# EAGLE board eTapper1main49 (EAGLE 8.4.3)
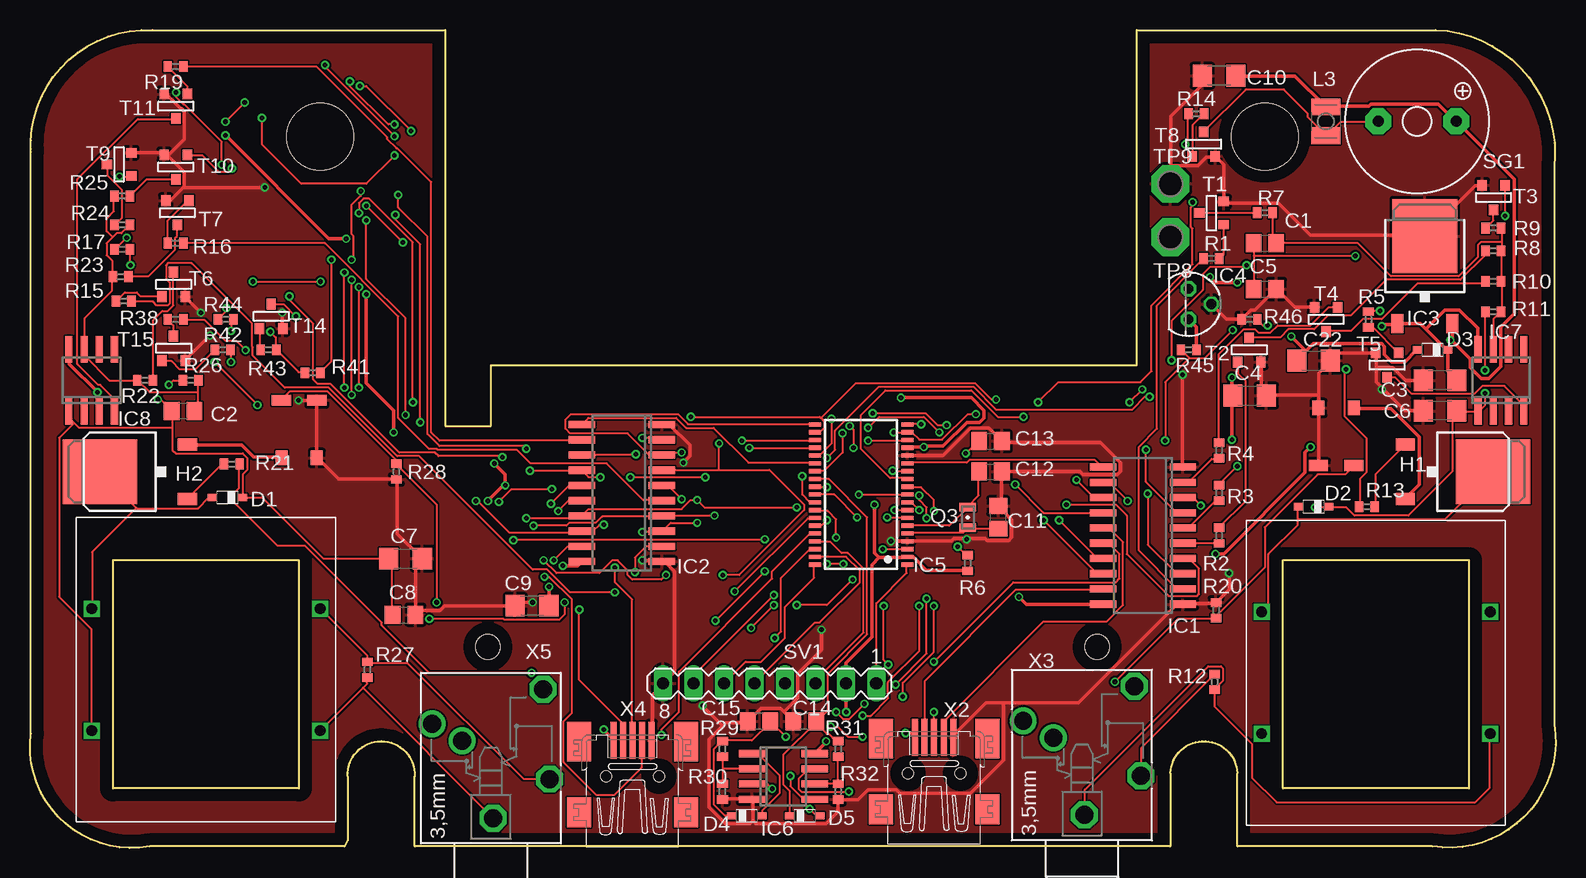
[diagram p1: board, top side]
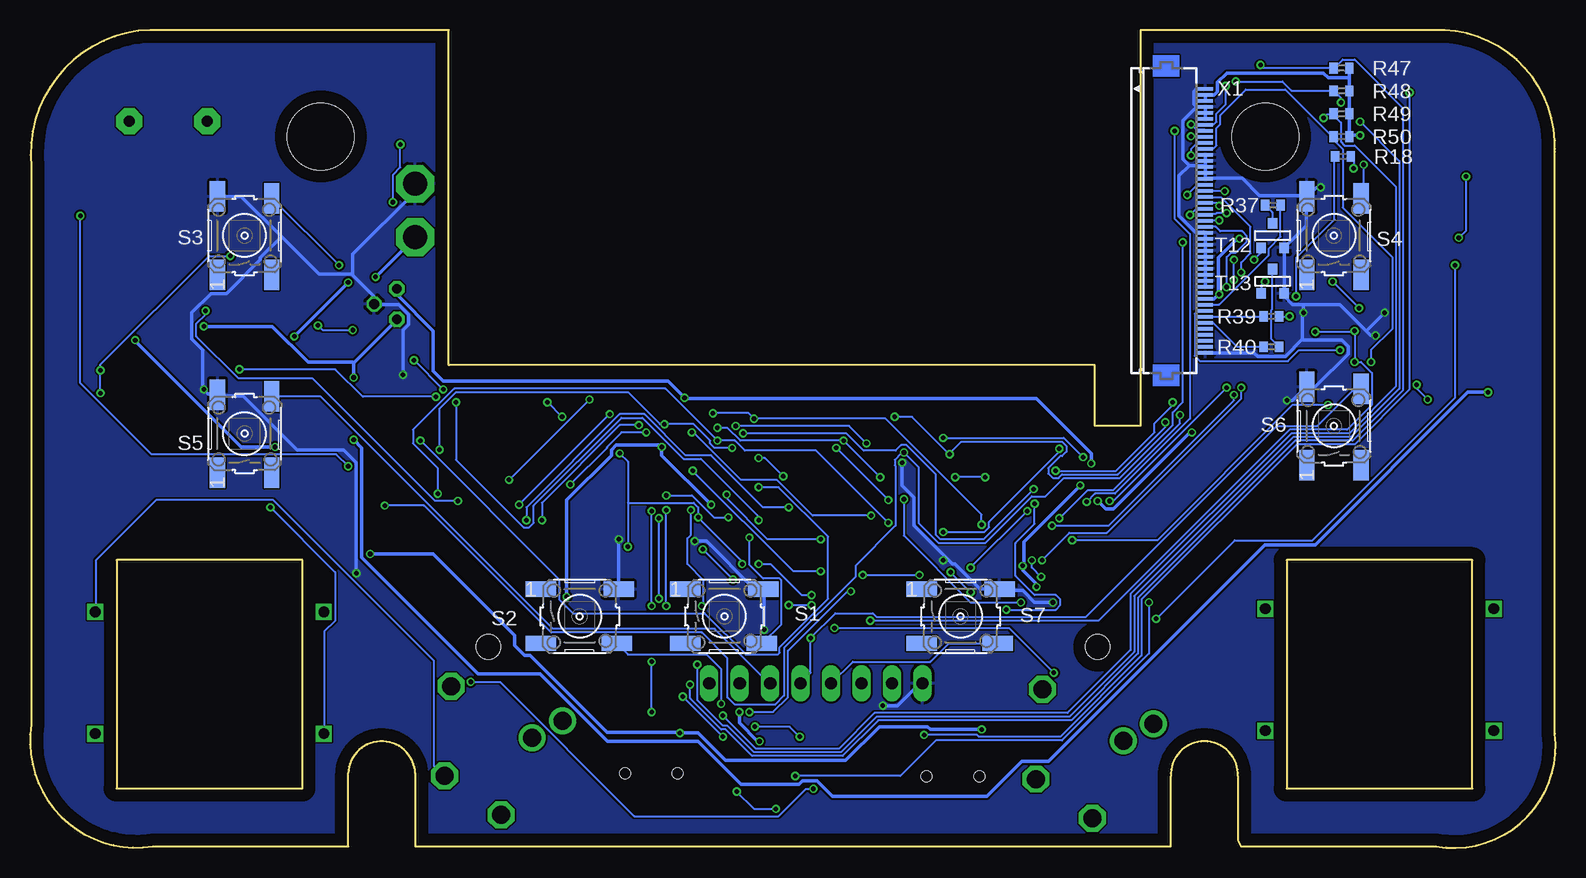
[diagram p2: board, bottom side, seen from below]

Size 127.17 x 68.21 mm. Coordinates in mm from the lower left corner, seen from the top.
Outline: 0.06,58.04 0.06,58.3 0.06,9.53
Outline: 0.06,58.04 0.06,9.53
Outline: 0.06,58.04 arc-96 10.22,68.2 34.61,68.2 34.61,35.18 38.42,35.18 38.42,40.26 92.27,40.26 92.27,68.2 117.16,68.2 arc-94 127.06,56.77 127.06,10.29 arc-108 116.9,0.13 100.65,0.13 100.65,6.23 arc175 95.06,6.23 95.06,0.13 32.07,0.13 32.07,5.97 arc185 26.48,5.97 26.48,0.64 26.23,0.13 9.97,0.13 arc-107 0.06,9.53
Outline: 104.46,24.01 119.95,24.01 119.95,4.96 104.46,4.96 104.46,24.01
Outline: 6.92,24.01 22.42,24.01 22.42,4.96 6.92,4.96 6.92,24.01
Copper layers (1*16): Top 0.035mm / dielectric 30mil / Bottom 0.035mm
Design rules "default *": minimum track width 6mil, minimum drill 15mil, track to track 6mil, track to pad 6mil, pad to pad 6mil, via to via 6mil, smd to smd 6mil, copper to edge 40mil, drill to drill 6mil, minimum pad ring 6mil, minimum via ring 6mil, stop-mask expansion 4mil, vias tented up to drill 0mil, thermal gap 10mil
Net classes: 1 GND: width 0.305 mm, clearance 0.152 mm; 2 BAT+: width 0.305 mm, clearance 0.152 mm; 3 +9V: width 0.305 mm, clearance 0.152 mm; 4 +3V: width 0.305 mm, clearance 0.152 mm; 5 VCC: width 0.305 mm, clearance 0.152 mm
Holes 5.59 mm at 24.19,59.31 102.93,59.31
Holes 2.03 mm at 38.16,16.77 88.96,16.77

## Footprints (pad centres in the part's own frame; a part is rotated, then mirrored left to right if it is on the bottom)
C0805 = smd 1.3 x 1.5: 1 -0.95,0; 2 0.95,0
C1206 = smd 1.6 x 1.8: 1 -1.4,0; 2 1.4,0
SOD323_ST = smd 0.8 x 0.6: A 1.25,0; C -1.25,0
XFMR = drill 0.889 square: P$1 -10.16,5.08; P$2 -10.16,-5.08; P$3 8.89,5.08; P$4 8.89,-5.08
D-PAK_TO252AA = smd 1 x 1.6: 1 -2.28,-4.8; 3 2.28,-4.8 | smd 5.4 x 6.2: 4 0,2.5
SO20 = smd 0.6 x 2.2: 1 -5.715,-3.33; 2 -4.445,-3.33; 3 -3.175,-3.33; 4 -1.905,-3.33; 5 -0.635,-3.33; 6 0.635,-3.33; 7 1.905,-3.33; 8 3.175,-3.33; 9 4.445,-3.33; 10 5.715,-3.33; 11 5.715,3.33; 12 4.445,3.33; 13 3.175,3.33; 14 1.905,3.33; 15 0.635,3.33; 16 -0.635,3.33; 17 -1.905,3.33; 18 -3.175,3.33; 19 -4.445,3.33; 20 -5.715,3.33
TO252 = smd 1 x 1.6: 1 -2.28,-4.8; 3 2.28,-4.8 | smd 5.4 x 6.2: 2 0,2.5
TO92 = drill 0.813 pad 1.27 octagon: 1 -1.27,0; 2 0,1.905; 3 1.27,0
TSSOP38_R-PDSO-G38-DA = smd 0.35 x 1: 1 -5.85,-3.85; 2 -5.2,-3.85; 3 -4.55,-3.85; 4 -3.9,-3.85; 5 -3.25,-3.85; 6 -2.6,-3.85; 7 -1.95,-3.85; 8 -1.3,-3.85; 9 -0.65,-3.85; 10 0,-3.85; 11 0.65,-3.85; 12 1.3,-3.85; 13 1.95,-3.85; 14 2.6,-3.85; 15 3.25,-3.85; 16 3.9,-3.85; 17 4.55,-3.85; 18 5.2,-3.85; 19 5.85,-3.85; 20 5.85,3.85; 21 5.2,3.85; 22 4.55,3.85; 23 3.9,3.85; 24 3.25,3.85; 25 2.6,3.85; 26 1.95,3.85; 27 1.3,3.85; 28 0.65,3.85; 29 0,3.85; 30 -0.65,3.85; 31 -1.3,3.85; 32 -1.95,3.85; 33 -2.6,3.85; 34 -3.25,3.85; 35 -3.9,3.85; 36 -4.55,3.85; 37 -5.2,3.85; 38 -5.85,3.85
SO8 = smd 0.6 x 2.2: 1 -1.905,-2.6; 2 -0.635,-2.6; 3 0.635,-2.6; 4 1.905,-2.6; 5 1.905,2.6; 6 0.635,2.6; 7 -0.635,2.6; 8 -1.905,2.6
SO08 = smd 0.6 x 2.2: 1 -1.905,-2.6; 2 -0.635,-2.6; 3 0.635,-2.6; 4 1.905,-2.6; 5 1.905,2.6; 6 0.635,2.6; 7 -0.635,2.6; 8 -1.905,2.6
L2825P = smd 1.4 x 2.4: 1 -1.2,0; 2 1.2,0
FC-12M = smd 0.7 x 1.4: 1 -0.85,0; 2 0.85,0
R0402 = smd 0.7 x 0.9: 1 -0.65,0; 2 0.65,0
B3F-10XX = smd 2.54 x 1.27: 1 -3.251,2.261; 2 3.251,2.261; 3 -3.251,-2.261; 4 3.099,-2.261
F/QMBIII = drill 0.914 pad 2.159 octagon: + 3.251,0; - -3.251,0
MA08-1 = drill 1.016 long: 1 -8.89,0; 2 -6.35,0; 3 -3.81,0; 4 -1.27,0; 5 1.27,0; 6 3.81,0; 7 6.35,0; 8 8.89,0
SOT-23 = smd 0.787 x 0.889: 1 0.025,-1.016; 2 -0.94,1.016; 3 0.991,1.016
P1-20 = drill 2.007 pad 3.15 octagon: TP 0,0
CT02-250 = smd 1 x 1.2: P$1 -1.45,-2.4; P$2 1.5,-2.4 | smd 1.6 x 0.9: P$3 1.5,2.4; P$4 -1.45,2.4
FH12-45S-0.5SH = smd 0.3 x 1.3: 1 -13,3.25; 2 -12.5,3.25; 3 -12,3.25; 4 -11.5,3.25; 5 -11,3.25; 6 -10.5,3.25; 7 -10,3.25; 8 -9.5,3.25; 9 -9,3.25; 10 -8.5,3.25; 11 -8,3.25; 12 -7.5,3.25; 13 -7,3.25; 14 -6.5,3.25; 15 -6,3.25; 16 -5.5,3.25; 17 -5,3.25; 18 -4.5,3.25; 19 -4,3.25; 20 -3.5,3.25; 21 -3,3.25; 22 -2.5,3.25; 23 -2,3.25; 24 -1.5,3.25; 25 -1,3.25; 26 -0.5,3.25; 27 0,3.25; 28 0.5,3.25; 29 1,3.25; 30 1.5,3.25; 31 2,3.25; 32 2.5,3.25; 33 3,3.25; 34 3.5,3.25; 35 4,3.25; 36 4.5,3.25; 37 5,3.25; 38 5.5,3.25; 39 6,3.25; 40 6.5,3.25; 41 7,3.25; 42 7.5,3.25; 43 8,3.25; 44 8.5,3.25; 45 9,3.25
32005-201 = smd 3.1 x 0.5: 1 3,1.6; 2 3,0.8; 3 3,0; 4 3,-0.8; 5 3,-1.6 | smd 2.5 x 2: M1 -3,-4.45; M2 -3,4.45 | smd 3.3 x 2: M3 2.9,4.45; M4 2.9,-4.45 | hole 0.9: 0,2.2; 0,-2.2
PG203J = drill 1.499 octagon: 1 -5.004,-0.203; 4 5.74,-4.369; 5 -1.753,-4.902 | drill 1.499: 2 2.845,4.902; 3 1.448,2.388

## Placement (x,y rotation side)
C1  .01uF  [C0805]  102.93,50.42 0 top
C2  .01uF  [C0805]  12.76,36.45 0 top
C3  [C1206]  117.54,38.99 180 top
C4  [C1206]  101.66,37.72 0 top
C5  3.3uF  [C0805]  102.93,46.61 0 top
C6  220uF  [C1206]  117.54,36.45 180 top
C7  220uF  [C1206]  31.31,24.14 0 top
C8  3.3uF  [C0805]  31.18,19.44 0 top
C9  47uF  [C1206]  41.85,20.2 180 top
C10  47uF  [C1206]  99.12,64.39 180 top
C11  12pF  [C0805]  80.71,27.56 90 top
C12  12pF  [C0805]  80.07,31.37 0 top
C13  1 uF  [C0805]  80.07,33.91 0 top
C14  0.1uF  [C0805]  64.58,10.55 180 top
C15  0.1uF  [C0805]  60.77,10.55 180 top
C22  220uF  [C1206]  107,40.65 0 top
D1  BAT60J  [SOD323_ST]  16.45,29.22 180 top
D2  BAT60J  [SOD323_ST]  107,28.45 180 top
D3  BAT60J  [SOD323_ST]  116.9,41.53 180 top
D4  BAT60J  [SOD323_ST]  59.75,2.67 0 top
D5  BAT60J  [SOD323_ST]  64.58,2.67 0 top
DRILEGEND  [DRILEGEND]  -4.51,-8.34 0 top  (outside the outline)
F1  XFMR  [XFMR]  112.84,14.61 0 top
F2  XFMR  [XFMR]  15.3,14.86 0 top
H1  IRLR024N  [D-PAK_TO252AA]  119.44,31.37 270 top
H2  IRLR024N  [D-PAK_TO252AA]  8.32,31.37 90 top
IC1  74AC373  [SO20]  92.77,26.04 90 top
IC2  74AC373  [SO20]  49.34,29.6 90 top
IC3  LM2936DT-5.0  [TO252]  116.27,48.52 0 top
IC4  LM2936Z-3.0  [TO92]  96.58,45.34 270 top
IC5  MSP430F2232IDA  [TSSOP38_R-PDSO-G38-DA]  69.28,29.47 90 top
IC6  AD8620R  [SO8]  62.8,5.97 270 top
IC7  LP2951M  [SO08]  122.62,38.99 0 top
IC8  LP2951M  [SO08]  5.14,38.99 0 top
L3  470uH  [L2825P]  108.01,60.58 270 top
Q3  FC-12M  [FC-12M]  78.17,27.56 90 top
R1  47K  [R0402]  98.49,49.15 0 top
R2  47K  [R0402]  99.12,26.04 90 top
R3  47K  [R0402]  99.12,29.6 90 top
R4  47K  [R0402]  99.12,33.15 90 top
R5  47K  [R0402]  111.57,44.07 270 top
R6  47K  [R0402]  78.17,23.75 270 top
R7  1K  [R0402]  102.93,52.96 0 top
R8  3K  [R0402]  121.98,49.79 0 top
R9  6K  [R0402]  121.98,51.69 0 top
R10  12K  [R0402]  121.98,47.25 0 top
R11  3K  [R0402]  121.98,44.71 0 top
R12  51K  [R0402]  98.74,13.85 270 top
R13  1K  [R0402]  111.44,28.45 0 top
R14  1K  [R0402]  97.22,61.22 0 top
R15  47K  [R0402]  7.81,45.6 180 top
R16  47K  [R0402]  12.13,50.42 180 top
R17  47K  [R0402]  7.68,49.92 180 top
R18  47K  [R0402]  17.72,57.66 0 bottom
R19  47K  [R0402]  12.13,65.16 180 top
R20  47K  [R0402]  98.87,19.82 90 top
R21  1K  [R0402]  16.83,32.01 180 top
R22  1K  [R0402]  9.59,38.99 180 top
R23  3K  [R0402]  7.56,47.63 180 top
R24  6K  [R0402]  7.68,51.95 0 top
R25  12K  [R0402]  7.68,54.36 180 top
R26  3K  [R0402]  13.4,38.99 0 top
R27  51K  [R0402]  28.13,14.86 270 top
R28  47K  [R0402]  30.54,31.37 270 top
R29  50K  [R0402]  57.72,8.26 90 top
R30  1K  [R0402]  57.72,4.7 90 top
R31  50K  [R0402]  67.37,8.26 90 top
R32  1K  [R0402]  67.37,4.7 90 top
R37  100  [R0402]  23.56,53.6 0 bottom
R38  100  [R0402]  12.13,44.07 0 top
R39  100  [R0402]  23.69,44.33 180 bottom
R40  100  [R0402]  23.69,41.79 180 bottom
R41  47K  [R0402]  23.56,39.63 0 top
R42  47K  [R0402]  16.07,41.53 180 top
R43  47K  [R0402]  19.88,41.53 180 top
R44  47K  [R0402]  16.32,44.07 180 top
R45  47K  [R0402]  96.58,41.53 0 top
R46  10K  [R0402]  101.66,44.07 0 top
R47  47K  [R0402]  17.84,65.03 0 bottom
R48  47K  [R0402]  17.84,63.12 0 bottom
R49  47K  [R0402]  17.84,61.22 0 bottom
R50  47K  [R0402]  17.84,59.31 0 bottom
S1  [B3F-10XX]  69.28,19.31 0 bottom
S2  [B3F-10XX]  81.34,19.31 0 bottom
S3  [B3F-10XX]  109.28,51.06 90 bottom
S4  [B3F-10XX]  18.48,51.06 90 bottom
S5  [B3F-10XX]  109.28,34.55 90 bottom
S6  [B3F-10XX]  18.48,35.18 90 bottom
S7  [B3F-10XX]  49.59,19.31 0 bottom
SG1  F/QMBIII  [F/QMBIII]  115.63,60.58 0 top
SV1  100mil  [MA08-1]  61.66,13.72 180 top
T1  2N3904  [SOT-23]  98.49,52.96 270 top
T2  2N3904  [SOT-23]  101.66,41.53 180 top
T3  2N3904  [SOT-23]  121.98,54.23 0 top
T4  2N3904  [SOT-23]  108.01,44.07 0 top
T5  2N3904  [SOT-23]  113.09,40.26 0 top
T6  2N3904  [SOT-23]  12,47 180 top
T7  2N3904  [SOT-23]  12.26,52.96 0 top
T8  2N3904  [SOT-23]  97.85,58.68 180 top
T9  2N3904  [SOT-23]  7.43,57.03 270 top
T10  2N3904  [SOT-23]  12.13,56.77 0 top
T11  2N3904  [SOT-23]  12.13,61.85 0 top
T12  2N3904  [SOT-23]  23.56,51.06 180 bottom
T13  2N3904  [SOT-23]  23.56,47.25 180 bottom
T14  2N3904  [SOT-23]  20.13,44.33 180 top
T15  2N3904  [SOT-23]  12,41.66 180 top
TP8  TPSPAD1-20  [P1-20]  95.06,50.93 0 top
TP9  TPSPAD1-20  [P1-20]  95.06,55.38 0 top
U$1  CT02-250  [CT02-250]  108.9,34.3 180 top
U$2  CT02-250  [CT02-250]  22.42,34.93 0 top
X1  FH12-45S-0.5SH  [FH12-45S-0.5SH]  32.45,50.3 270 bottom
X2  MINI-USB-SCHIELD-32005-201  [32005-201]  75.37,6.23 90 top
X3  PG203J  [PG203J]  87.69,7.75 90 top
X4  MINI-USB-SCHIELD-32005-201  [32005-201]  50.23,5.97 90 top
X5  PG203J  [PG203J]  38.42,7.5 90 top

## Tracks (layer width: path | path; a pad name or v marks a point on that pad's centre or on a via)
+3V  (via drill 0.38)
  Top 0.305: v26.35,50.81 24.9,50.81 v16.29,59.42 | v66.36,8.9 66.36,8.82 65.44,7.9 IC6.8 | v68.03,11.33 68.03,13.7 SV1.2 68.03,13.85 68.03,15.45 70.17,17.58 70.17,23.6 70.78,24.21 | v43.27,21.77 43.27,20.25 C9.1 | v44.41,23.53 45.63,23.53 45.94,23.83 IC2.20 | R6.2 78.17,23.14 74.74,23.14 73.67,24.21 73.14,24.21 IC5.2 72.99,24.21 70.78,24.21 | v70.4,28.63 70.4,24.59 70.78,24.21 | IC5.16 73.14,33.43 v74.51,33.43 74.59,33.51 76.11,33.51 78.09,35.49 79.16,35.49 79.54,35.87 79.54,36.48 78.47,37.55 v72.61,37.55 | IC1.20 83.05,20.33 v82.44,20.94 | v38.7,32.06 39.61,31.15 v39.61,30.23 39.54,30.31 v38.16,28.94 | v28.03,46.16 28.03,38.77 30.31,36.48 v30.31,34.65
  Bottom 0.305: X1.3 29.17,62.31 29.17,62.77 X1.2 29.02,62.77 28.49,62.77 28.18,63.07 28.18,63.84 27.42,64.6 19.34,64.6 18.96,64.22 17.21,64.22 | 17.21,64.22 17.21,63.23 R48.2 17.21,63.07 17.21,61.32 R49.2 17.21,61.17 17.21,59.34 R50.2 17.13,59.42 v16.29,59.42 | 17.21,64.22 17.21,64.98 R47.2 | 28.11,46.16 28.49,45.78 29.17,45.78 X1.36 | 28.11,46.16 28.11,49.21 26.5,50.81 v26.35,50.81 | v66.36,8.9 66.51,8.9 68.03,10.42 v68.03,11.33 | v43.27,21.77 43.27,22 44.41,23.14 v44.41,23.53 44.34,23.6 44.34,25.51 v39.61,30.23 | v70.4,28.63 74.51,32.75 v74.51,33.43 74.66,33.58 78.32,33.58 78.7,33.2 78.7,32.75 82.44,29.01 v82.44,20.94 | IC4.1 96.53,46.61 96.53,46.08 93.56,43.11 93.56,39.76 92.72,38.92 73.98,38.92 v72.61,37.55 72.53,37.47 43.27,37.47 38.7,32.9 v38.7,32.06 | v30.31,34.65 30.47,34.65 36.87,28.25 37.48,28.25 v38.16,28.94 | v28.03,46.16 28.11,46.16
+9V  (via drill 0.38)
  Top 0.305: C3.1 118.17,39.76 118.17,41.51 D3.C 118.02,41.59 116.34,43.26 | 116.34,43.26 115.89,43.72 114.06,43.72 IC3.1 113.91,43.64 112.84,43.64 v112.69,43.49 | 116.34,43.26 117.94,44.86 119.16,44.86 120.69,43.34 120.69,41.66 IC7.8 | R45.2 97.22,41.59 97.22,43.41 96.61,44.02 IC4.3 | v100.19,39.22 100.19,37.78 C4.1 100.19,37.62 v100.19,34.04 | v5.63,38 3.26,40.37 3.26,41.59 IC8.8
  Bottom 0.305: 100.19,40.44 v100.19,39.22 | 100.19,40.44 96.61,44.02 IC4.3 | v5.63,38 7.3,38 20.03,25.28 24.22,25.28 42.28,7.22 44.49,7.22 47.38,4.32 60.26,4.32 61.56,5.62 62.78,5.62 63.08,5.31 67.88,5.31 71.46,8.9 79.01,8.9 84.65,14.53 89.83,14.53 99.5,24.21 99.5,33.36 v100.19,34.04 | v112.69,43.49 106.97,43.49 104,40.52 100.27,40.52 100.19,40.44
/LCS  (via drill 0.38)
  Top 0.152: v26.66,63.91 26.66,63.53 29.86,60.33 v30.39,60.33 | v72.07,28.17 73.06,28.17 IC5.8 | v71.16,20.17 71.16,15.68 v71.54,15.3 | v17.89,62.16 v16.29,60.56
  Bottom 0.152: v26.66,63.91 22.77,63.91 22.01,63.15 18.5,63.15 R48.1 18.43,63.07 17.89,62.54 v17.89,62.16 | v30.39,60.33 29.93,59.87 29.25,59.87 X1.8 | v72.07,28.17 72.07,26.12 72.38,25.81 72.38,23.68 71.01,22.31 71.01,20.33 v71.16,20.17 | v71.54,15.3 71.54,12.32 69.41,10.19 69.02,10.19 66.81,7.98 59.58,7.98 56.6,10.95 40.53,10.95 35.12,16.36 35.12,21.01 21.86,34.27 17.06,34.27 13.02,38.31 13.02,57.28 v16.29,60.56
/RST  (via drill 0.38)
  Top 0.152: v77.33,25.13 78.02,24.44 78.17,24.44 R6.1 | v78.02,32.9 79.08,33.97 C13.1 | v71.46,27.56 73.06,27.56 IC5.7 | SV1.7 55.31,14.38 v62.01,21.09 | v67.81,23.68 v66.43,23.68
  Bottom 0.152: 77.33,28.78 77.33,32.21 v78.02,32.9 | 77.33,28.78 v77.33,25.13 | 77.33,28.78 71.84,28.78 71.46,28.4 v71.46,27.56 67.81,23.91 v67.81,23.68 | v62.01,21.09 62.85,21.09 65.44,23.68 v66.43,23.68
BAT+  (via drill 0.38)
  Top 0.305: D3.A 115.58,41.51 114.59,40.52 113.53,40.52 112.92,41.13 112.92,41.81 112.69,42.04 106.97,42.04 105.6,40.67 C22.1 106.29,41.51 v105.14,42.65 | v100.65,47.15 98.82,47.15 v98.36,47.61
  Bottom 0.305: v100.65,47.15 v105.14,42.65 | v98.36,47.61 95.08,50.88 TP8.TP
GND  (via drill 0.38)
  Top 0.305: X4.5 51.88,9.05 51.88,12.78 52.72,13.62 SV1.8 52.79,13.77 53.71,14.69 53.71,23.07 52.95,23.83 52.72,23.83 IC2.1 52.57,23.98 v51.04,23.98 | v54.47,32.14 55,32.67 55,33.58 53.33,35.26 52.72,35.26 IC2.10 | 12.87,55.15 11.72,54.01 11.34,54.01 T7.2 | 12.87,55.15 12.87,56.37 11.49,57.74 11.19,57.74 T10.2 | T9.2 11.04,57.97 11.11,57.89 T10.2 | T11.2 11.19,62.85 11.34,62.85 12.56,61.63 12.64,61.63 12.87,61.4 12.87,59.11 11.57,57.82 T10.2 | v15,42.73 12.94,40.67 T15.2 | v14.24,44.63 12.94,45.93 T6.2 | v21.02,44.63 21.02,43.34 T14.2 | v19.57,55.07 12.94,55.07 12.87,55.15 | v22.39,37.32 23.76,37.32 U$2.P$3 23.91,37.32 23.91,32.67 U$2.P$2 23.99,32.52 25.74,30.76 30.54,30.76 R28.2 30.62,30.61 30.62,26.19 32.6,24.21 C7.2 32.68,24.14 32.14,23.6 32.14,19.49 C8.2 32.22,19.79 34.2,19.79 34.58,20.17 40.37,20.17 C9.2 40.53,20.33 40.68,20.48 v41.9,20.48 | T2.2 102.63,40.52 102.63,38.16 103.01,37.78 C4.2 103.16,37.78 107.43,37.78 | 107.43,37.78 107.43,39.6 108.34,40.52 C22.2 108.42,40.67 109.03,41.28 T5.2 112.23,41.2 112.23,40.06 | 107.43,37.78 107.43,36.71 U$1.P$2 107.43,36.56 107.43,31.91 U$1.P$3 | 112.76,38.31 112.23,38.84 112.23,40.06 | 112.76,38.31 114.59,36.48 116.12,36.48 C6.2 | C3.2 114.67,38.99 113.6,40.06 112.23,40.06 | v112.69,38.23 112.76,38.31 | T4.2 105.45,45.09 103.92,46.61 C5.2 103.77,46.54 102.1,44.86 101.79,44.86 101.1,44.18 R46.1 100.95,44.1 99.73,44.1 IC4.2 | v96.08,39.45 96.08,31.76 IC1.10 | T3.2 120.99,55.23 120.46,55.23 116.27,51.03 IC3.2 116.19,51.11 106.74,51.11 104.08,53.78 99.58,53.78 T1.2 99.5,56.98 98.82,57.66 T8.2 98.67,57.59 98.06,57.59 97.37,56.9 95.16,56.9 TP9.TP 95.08,55.38 95.08,61.02 97.68,63.61 97.68,64.37 C10.2
  Top 0.305: IC5.15 73.14,32.75 76.11,32.75 78.4,35.03 79.92,35.03 80.99,33.97 C13.2 81.14,33.81 89.22,33.81 90.89,32.14 90.89,31.37 90.67,31.15 87.77,31.15 87.54,31.37 C12.2 80.99,31.37 80.99,28.86 80.76,28.63 C11.2 80.76,28.48 81.83,27.41 81.83,25.89 81.6,25.66 79.77,25.66 79.62,25.81 78.09,25.81 | 78.09,25.81 77.03,25.81 76.8,25.58 73.14,25.58 IC5.4 72.99,25.58 v71.77,25.58 | v78.09,25.74 78.09,25.81 | 62.85,11.33 63.61,10.57 C14.2 | 62.85,11.33 62.55,11.64 60.95,11.64 59.88,10.57 C15.2 59.73,10.42 57.98,10.42 57.75,10.19 | R30.1 57.75,4.09 60.19,4.09 IC6.4 60.26,3.94 60.26,2.27 | 60.26,2.27 60.49,2.04 66.36,2.04 67.35,3.03 67.35,4.02 R32.1 67.5,4.02 69.02,4.02 69.86,4.86 72.22,4.86 72.53,4.55 78.4,4.55 81.14,7.3 81.14,12.1 | 57.75,10.19 56.6,9.05 56.6,3.41 57.98,2.04 60.03,2.04 60.26,2.27 | 81.14,12.1 79.69,12.1 77.03,9.43 77.03,9.28 X2.5 | 81.14,12.1 87.39,12.1 95.54,20.25 96,20.25 IC1.1 96.15,20.33 96.23,20.4 98.82,20.4 R20.2 98.97,20.55 99.96,21.54 v99.96,22.92 | v65.98,18.19 65.98,16.52 64,14.53 64,12.48 62.85,11.33 | 57.75,10.19 v56.07,11.87
  Bottom 0.305: v54.47,32.14 54.47,30.23 53.48,29.24 53.48,26.88 50.81,24.21 | 50.81,24.21 50.28,23.68 50.05,23.68 47.99,21.62 46.39,21.62 S7.2 46.24,21.47 44.41,21.47 43.42,20.48 v41.9,20.48 | 50.81,24.21 v51.04,23.98 | X1.34 29.17,46.84 29.17,47.22 X1.33 29.17,47.45 29.17,47.76 X1.32 29.17,47.91 29.17,48.29 X1.31 29.17,48.44 29.17,48.75 X1.30 29.17,48.9 29.17,49.28 X1.29 29.17,49.43 29.17,49.74 X1.28 29.17,49.89 29.17,50.27 X1.27 29.17,50.42 29.17,50.73 X1.26 29.17,50.88 29.17,51.26 X1.25 29.32,51.34 30.01,51.34 31.38,52.71 31.38,56.06 30.54,56.9 | X1.14 29.17,56.75 29.17,56.44 X1.15 29.17,56.29 29.17,55.83 X1.16 29.02,55.83 26.12,55.83 24.68,54.39 20.87,54.39 S4.2 | X1.14 29.17,56.9 29.17,57.28 X1.13 29.17,57.43 29.17,57.74 X1.12 | X1.6 29.17,60.86 29.17,61.24 X1.5 29.17,61.4 29.17,61.78 X1.4 29.32,61.78 29.93,61.78 | 29.93,61.78 30.16,62.01 30.16,63.07 29.93,63.3 29.25,63.3 X1.1 | 30.54,56.9 29.32,56.9 X1.14 | 30.54,56.9 31.08,57.43 31.08,60.64 29.93,61.78 | v15,42.73 15.38,42.73 15.76,43.11 | 15.76,43.11 17.97,45.32 21.02,45.32 | 21.02,45.32 21.93,45.32 22.62,46 T13.2 T12.2 20.79,51.87 20.79,54.31 S4.2 | 15.76,43.11 v14.24,44.63 | 21.02,45.32 v21.02,44.63 21.09,44.56 21.09,42.42 | 21.09,42.42 22.54,40.98 24.83,40.98 25.13,41.28 29.17,41.28 X1.45 | 21.09,42.42 21.02,42.35 17.82,42.35 17.28,41.81 17.28,41.2 20.03,38.46 20.71,38.46 S6.2 20.87,38.38 21.93,37.32 v22.39,37.32 | v19.57,55.07 19.95,55.07 20.64,54.39 S4.2 | v96.08,39.45 96.08,43.19 95.62,43.64 95.62,44.48 96.46,45.32 98.44,45.32 IC4.2 98.51,45.47 98.51,46 100.34,47.83 | S3.2 109.56,54.31 106.21,50.96
  Bottom 0.305: 106.21,50.96 103.09,47.83 100.34,47.83 | 106.21,50.96 107.96,49.21 107.96,49.05 110.78,46.23 112.08,46.23 113.68,44.63 113.68,42.42 112.76,41.51 112.76,38.31 v112.69,38.23 112.31,37.85 111.54,37.85 S5.2 111.47,37.7 109.41,37.7 104.91,33.2 101.03,33.2 99.96,32.14 v99.96,22.92 | 100.34,47.83 100.27,47.91 100.27,49.51 95.08,54.69 95.08,55.38 TP9.TP | v71.77,25.58 70.78,25.58 66.81,21.62 66.05,21.62 S1.2 65.98,21.47 v65.98,18.19 | v78.09,25.74 S2.2 | v56.07,11.87 54.85,11.87 53.02,13.7 52.79,13.7 SV1.8
  pour Top: 0.06,68.71 127.06,68.71 127.06,0.13 0.06,0.13
  pour Bottom: 0.06,68.71 127.06,68.71 127.06,0.13 0.06,0.13
IO1_0  (via drill 0.38)
  Top 0.152: v67.2,25.89 67.2,27.41 66.51,28.1 65.44,28.1 IC5.31
  Bottom 0.152: v67.2,25.89 67.2,23.6 66.05,22.46 64.68,22.46 64.53,22.31 64.53,18.65 66.13,17.05 S1.4
IO1_1  (via drill 0.38)
  Top 0.152: v58.74,21.39 64.83,27.49 65.37,27.49 IC5.32 | v67.2,11.33 67.81,10.72 68.26,10.72 v69.56,12.02
  Bottom 0.152: v58.74,21.39 59.04,21.39 64,16.44 64,12.55 65.21,11.33 v67.2,11.33 | v69.56,12.02 69.56,14.92 70.78,16.13 77.33,16.13 S2.4
IO1_2  (via drill 0.38)
  Top 0.152: v66.43,27.34 65.98,26.88 IC5.33 | v92.72,38.23 v91.66,37.17 | v95.16,40.67 95.16,43.95 97.75,46.54 97.75,47.83 98.36,48.44 101.26,48.44 v101.41,48.6
  Bottom 0.152: v66.43,27.34 66.43,27.64 71.23,32.44 72.68,32.44 76.11,35.87 77.86,35.87 85.18,28.56 85.18,27.11 85.56,26.73 86.02,26.73 91.66,32.37 v91.66,37.17 | v95.16,40.67 v92.72,38.23 | v101.41,48.6 106.97,54.16 S3.4
IO1_3  (via drill 0.38)
  Top 0.152: v52.64,9.43 52.64,9.89 54.09,11.33 54.09,14.69 61.86,22.46 61.86,23.07 64.99,26.19 65.37,26.19 IC5.34 | v12.18,63 12.18,62.62 12.79,62.01 12.87,62.01 15.99,58.88 v15.99,56.98
  Bottom 0.152: v52.64,9.43 48.22,9.43 48.07,9.28 41.29,9.28 34.51,16.06 34.51,20.71 21.55,33.66 16.75,33.66 12.18,38.23 v12.18,63 | v15.99,56.98 15.99,54.39 S4.4
IO4_0  (via drill 0.38)
  Top 0.152: v69.86,33.97 73.06,33.97 IC5.17 | v55.61,27.11 53.4,27.11 52.72,26.42 IC2.3 52.64,26.42 52.57,26.35 v51.04,26.35 | v30.7,54.46 30.7,53.4 33.13,50.96 33.13,34.5 34.12,33.51 41.14,33.51 v41.36,33.28 | v93.18,29.55 93.18,25.28 95.54,22.92 96.08,22.92 IC1.3
  Bottom 0.152: v55.61,27.11 61.63,33.13 67.58,33.13 68.41,33.97 v69.86,33.97 74.21,38.31 91.81,38.31 95.24,34.88 95.24,33.74 93.18,31.68 v93.18,29.55 | v30.7,54.46 29.93,55.23 29.25,55.23 X1.17 | v41.36,33.28 41.36,33.05 47.23,27.18 47.23,26.73 47.61,26.35 v51.04,26.35
IO4_1  (via drill 0.38)
  Top 0.152: v72,34.65 73.06,34.65 IC5.18 73.14,34.65 73.52,34.65 74.13,34.04 76.03,34.04 78.17,36.18 v78.85,36.18 | v57.06,27.72 52.72,27.72 IC2.4 52.64,27.64 47.69,27.64 47.16,27.11 44.95,27.11 44.72,26.88 v41.97,26.88 | v27.57,54.77 27.57,54.39 26.81,53.62 26.81,51.19 26.96,51.03 26.96,49.21 v26.81,49.05 | v26.81,37.78 v26.81,47.38 | IC1.4 96.61,24.14 97.45,23.3 97.45,21.16 97.29,21.01 94.93,21.01 91.43,24.52 91.43,27.72 90.51,28.63 v86.4,28.63
  Bottom 0.152: v72,34.65 71.84,34.65 67.88,30.69 64.91,30.69 61.94,27.72 v57.06,27.72 | v27.57,54.77 29.17,54.77 X1.18 | v26.81,47.38 v26.81,49.05 | v26.81,37.78 26.81,37.32 37.25,26.88 v41.97,26.88 | v78.85,36.18 v86.4,28.63
IO4_2  (via drill 0.38)
  Top 0.152: v74.28,35.34 73.14,35.34 IC5.19 | v93.03,33.2 93.03,30.54 95.62,27.95 IC1.7 | v26.2,38.38 v26.2,47.99 | v42.81,23.98 43.88,22.92 47.46,22.92 48.53,23.98 48.98,23.98 49.82,23.14 49.82,22.76 50.2,22.38 52.64,22.38 v53.02,22.76 | v57.75,22.76 59.12,22.76 64.53,28.17 64.53,28.63 61.63,31.53 57.44,31.53 | 57.44,31.53 52.72,31.53 IC2.7 | v68.64,33.36 68.64,34.88 v68.34,35.18 | 57.44,31.53 v57.44,33.74
  Bottom 0.152: v93.03,33.2 93.03,36.63 91.66,38 77.33,38 74.66,35.34 v74.28,35.34 71.84,35.34 70.47,33.97 70.47,33.74 70.09,33.36 v68.64,33.36 | v26.2,47.99 26.2,48.82 25.44,49.59 25.44,51.8 27.88,54.23 29.17,54.23 X1.19 | v26.2,38.38 26.2,37.47 37.4,26.27 40.53,26.27 v42.81,23.98 | v57.75,22.76 v53.02,22.76 | v68.34,35.18 58.89,35.18 v57.44,33.74
IO4_3  (via drill 0.38)
  Top 0.152: IC5.20 65.37,35.34 54.85,35.34 54.01,36.18 45.1,36.18 44.64,35.72 44.64,34.96 45.02,34.57 49.82,34.57 51.57,32.82 52.64,32.82 IC2.8 52.72,32.82 52.87,32.97 v54.32,32.97 | v31.08,50.5 v28.03,53.55 | v97.6,28.56 96.99,29.16 96.15,29.16 IC1.8
  Bottom 0.152: v28.03,53.55 28.26,53.78 29.17,53.78 X1.20 | v31.08,50.5 31.08,37.17 31.92,36.33 31.92,35.26 36.33,30.84 40.98,30.84 42.51,29.32 43.65,29.32 47.54,25.43 51.42,25.43 53.1,27.11 53.1,31.76 v54.32,32.97 54.32,32.9 54.55,32.9 55.08,32.37 55.08,31.91 55,31.83 55,26.88 58.36,23.53 58.36,22.61 64.3,16.67 64.3,12.71 65.06,11.94 68.41,11.94 69.02,12.55 69.02,15.83 71.16,17.96 83.73,17.96 94.32,28.56 v97.6,28.56
IO4_4  (via drill 0.38)
  Top 0.152: 65.94,35.83 65.82,35.95 v55.08,35.95 | 65.94,35.83 66.21,35.57 66.21,35.03 65.9,34.73 65.44,34.73 IC5.21 | v50.51,32.82 46.01,32.82 IC2.13 | v30.47,52.79 30.47,52.41 32.52,50.35 v32.52,35.49 | v87.24,30.69 88.68,29.24 89.37,29.24 IC1.13 | v80.53,37.39 80.15,37.39 78.78,38.77 68.87,38.77 65.94,35.83
  Bottom 0.152: v55.08,35.95 53.63,35.95 v50.51,32.82 50.51,32.9 49.52,33.89 41.14,33.89 40.75,33.51 40.75,33.05 41.14,32.67 41.29,32.67 42.28,31.68 42.28,31.22 41.9,30.84 41.44,30.84 41.14,31.15 36.49,31.15 32.52,35.11 v32.52,35.49 | v30.47,52.79 30.01,53.24 29.25,53.24 X1.21 | v80.53,37.39 v87.24,30.69
IO4_5  (via drill 0.38)
  Top 0.152: v59.35,33.97 65.37,33.97 IC5.22 | v50.05,30.92 v56.3,30.92 | v47.54,30.92 46.55,30.92 46.01,31.45 IC2.14 45.94,31.45 v41.67,31.45 | v27.42,52.94 27.42,53.78 27.8,54.16 28.26,54.16 31.92,50.5 v31.92,37.17 | IC1.14 84.49,27.95 v82.13,30.31 | v75.81,34.65 74.51,35.95 70.78,35.95 v69.86,35.03
  Bottom 0.152: v56.3,30.92 v59.35,33.97 67.96,33.97 69.02,35.03 v69.86,35.03 | v47.54,30.92 v50.05,30.92 | v27.42,52.94 28.26,52.94 28.33,52.86 29.17,52.86 X1.22 | v31.92,37.17 31.92,36.94 33.44,35.41 33.44,34.65 36.64,31.45 v41.67,31.45 | v82.13,30.31 79.08,33.36 79.08,33.43 77.86,34.65 v75.81,34.65
IO4_6  (via drill 0.38)
  Top 0.152: v59.96,33.36 65.37,33.36 IC5.23 | v28.03,52.33 28.03,47.45 31.31,44.18 v31.31,36.1 | v41.36,27.49 45.78,27.49 45.94,27.64 IC2.17 46.01,27.72 46.55,28.25 54.32,28.25 55.08,29.01 v55.61,29.01 56.22,28.4 v63.92,28.4 | IC1.17 88.99,24.14 v85.79,27.34
  Bottom 0.152: v55.61,29.01 v59.96,33.36 | v28.03,52.33 29.17,52.33 X1.23 | v31.31,36.1 31.31,35.41 36.87,29.85 39,29.85 v41.36,27.49 | v85.79,27.34 85.79,28.4 78.02,36.18 75.96,36.18 72.53,32.75 70.4,32.75 66.05,28.4 v63.92,28.4
IO4_7  (via drill 0.38)
  Top 0.152: v66.81,35.79 66.81,33.74 65.82,32.75 65.44,32.75 IC5.24 | v47.84,26.95 47.46,26.95 46.93,26.42 IC2.18 45.94,26.42 45.78,26.27 39.99,26.27 37.33,28.94 v37.17,28.94 | v27.42,38.38 v27.42,46.77 | v84.49,27.34 88.91,22.92 89.37,22.92 IC1.18 | v76.42,35.26 75.65,35.26 74.66,36.25 v70.24,36.25
  Bottom 0.152: v47.84,26.95 47.84,27.79 55.84,35.79 v66.81,35.79 67.27,36.25 v70.24,36.25 | v27.42,46.77 27.42,49.28 27.04,49.66 26.66,49.66 25.74,50.58 25.74,51.03 26.12,51.42 27.95,51.42 28.33,51.8 29.17,51.8 X1.24 | v27.42,38.38 36.87,28.94 v37.17,28.94 | v84.49,27.34 84.49,28.78 78.02,35.26 v76.42,35.26
LADC  (via drill 0.38)
  Top 0.152: D4.C 58.43,2.72 57.9,2.72 56.98,3.64 56.98,8.21 57.67,8.9 R29.2 57.75,8.97 60.19,8.97 61.71,10.5 C15.1 61.79,10.5 v63,9.28 | v75.35,28.1 75.35,29.01 74.28,30.08 73.14,30.08 IC5.11 | v75.35,20.17 75.35,16.36 72.76,13.77 v72.76,12.63 | v69.41,9.28 68.19,9.28 67.35,10.11 v66.74,10.11
  Bottom 0.152: v75.35,20.17 v75.35,28.1 | v69.41,9.28 v72.76,12.63 | v66.74,10.11 63.84,10.11 v63,9.28
LCLOCK  (via drill 0.38)
  Top 0.152: v75.35,15.52 81.98,22.15 90.51,22.15 90.82,22.46 90.82,24.52 89.98,25.35 89.45,25.35 IC1.16 | v75.35,11.33 75.35,9.28 X2.3
  Bottom 0.152: v75.35,11.33 v75.35,15.52
LCLR
  Top 0.152: IC1.19 89.37,21.54 82.21,21.54 74.59,13.92 74.59,9.28 X2.2
LD_/C  (via drill 0.38)
  Top 0.152: v24.6,65.28 24.6,65.13 v30.39,59.34 | IC5.29 67.04,29.47 v68.95,27.56 | v74.13,29.39 74.13,29.01 74.74,28.4 v74.74,27.49 | v74.74,20.78 74.74,16.21 v72.15,13.62
  Bottom 0.152: v24.6,65.28 24.37,65.05 18.5,65.05 R47.1 18.43,65.05 17.74,65.74 16.75,65.74 12.71,61.7 12.71,38.16 16.9,33.97 21.7,33.97 34.81,20.86 34.81,16.21 40.37,10.65 56.45,10.65 59.42,7.68 66.97,7.68 69.18,9.89 69.56,9.89 72.15,12.48 v72.15,13.62 | v30.39,59.34 29.25,59.34 X1.9 | v68.95,27.56 70.17,27.56 72,29.39 v74.13,29.39 | v74.74,20.78 v74.74,27.49
LDIN
  Top 0.152: IC1.15 89.45,26.65 89.98,26.65 91.12,25.51 91.12,20.25 89.75,18.88 84.49,18.88 76.19,10.57 76.19,9.28 X2.4
LEDK1
  Bottom 0.152: R37.2 22.92,53.55 22.92,50.96 23.91,49.97 23.91,49.43 28.03,45.32 29.17,45.32 X1.37
LEDK2  (via drill 0.38)
  Top 0.152: v17.97,41.51 17.21,42.27 16.29,42.27 14.54,44.02 12.79,44.02 R38.2
  Bottom 0.152: v17.97,41.51 21.4,41.51 22.31,40.59 29.63,40.59 30.09,41.05 30.09,44.56 29.86,44.79 29.25,44.79 X1.38
LEDK3
  Bottom 0.152: R39.2 29.17,44.33 X1.39
LEDK4
  Bottom 0.152: R40.2 24.37,41.81 26.58,41.81 28.56,43.8 29.17,43.8 X1.40
LHVTRIG  (via drill 0.38)
  Top 0.152: v109.72,39.91 109.56,39.76 109.56,36.02 111.39,34.19 111.39,31.3 110.86,30.76 110.86,28.48 R13.1 | v93.33,37.62 92.95,37.62 91.88,36.56 80.53,36.56 78.63,38.46 70.78,38.46 67.12,34.8 67.12,33.2 v66.43,32.52 | v64.38,30.99 64.38,29.47 64.99,28.86 65.37,28.86 IC5.30
  Bottom 0.152: v109.72,39.91 101.71,39.91 99.43,37.62 v93.33,37.62 | v66.43,32.52 65.9,32.52 v64.38,30.99
LLED  (via drill 0.38)
  Top 0.152: R41.1 22.85,39.68 22.39,39.68 20.56,41.51 R43.1 20.49,41.59 20.49,42.58 v20.03,43.03 | v16.75,40.52 16.75,41.51 R42.1 | v16.75,43.11 16.75,43.87 16.9,44.02 R44.1 | v71.92,31.45 73.06,31.45 IC5.13 | v57.14,18.95 v61.25,23.07
  Bottom 0.152: 16.75,43.03 v16.75,40.52 16.22,40.52 15.3,39.6 15.3,36.94 17.36,34.88 22.16,34.88 38.09,18.95 v57.14,18.95 | v71.92,31.45 63.54,23.07 v61.25,23.07 | 16.75,43.03 v20.03,43.03 | 16.75,43.03 v16.75,43.11
LOPA  (via drill 0.38)
  Top 0.152: U$1.P$4 110.32,31.83 109.64,31.15 107.35,31.15 102.93,26.73 102.93,23.37 98.89,19.33 98.89,19.18 R20.1 98.82,19.11 95.69,19.11 v90.44,13.85 | v61.86,4.93 61.48,5.31 60.26,5.31 IC6.3
  Bottom 0.152: v61.86,4.93 62.47,4.93 64.76,2.65 76.8,2.65 88,13.85 v90.44,13.85
LRD  (via drill 0.38)
  Top 0.152: v69.1,29.47 IC5.10 | v61.25,25.74 40.37,25.74 v40.3,25.66 | v15.38,40.52 v18.96,36.94
  Bottom 0.152: X1.11 29.17,58.35 28.49,58.35 28.26,58.58 28.26,60.03 27.95,60.33 27.95,61.09 25.82,63.23 22.54,63.23 18.66,59.34 18.5,59.34 R50.1 18.43,59.26 18.43,58.96 17.74,58.27 17.74,53.4 13.63,49.28 13.63,43.26 15.38,41.51 v15.38,40.52 | v69.1,29.47 69.1,29.16 65.67,25.74 v61.25,25.74 | v40.3,25.66 33.21,25.66 21.93,36.94 v18.96,36.94
LRESET  (via drill 0.38)
  Top 0.152: v67.73,34.57 67.73,32.97 66.21,31.45 65.44,31.45 IC5.26 | v43.5,29.93 40.14,29.93 v39.08,28.86 | v31.76,59.8 28.03,63.53 v27.5,63.53
  Bottom 0.152: v67.73,34.57 59.12,34.57 57.67,33.13 55,33.13 54.55,33.58 54.09,33.58 51.65,31.15 51.65,26.12 51.27,25.74 47.69,25.74 v43.5,29.93 | v39.08,28.86 38.39,29.55 36.72,29.55 30.47,35.79 30.47,51.19 31.76,52.48 v31.76,59.8 | v27.5,63.53 27.5,62.01 28.26,61.24 28.26,60.56 28.49,60.33 29.17,60.33 X1.7
LTS+
  Top 0.152: X3.1 87.92,2.8 87.92,4.86 98.21,15.14 99.28,15.14 99.43,14.99 99.43,13.92 98.74,13.24 R12.2 98.74,11.79 101.87,8.67 101.87,5.85 103.92,3.79 120.46,3.79 121.68,5.01 121.68,9.51 F1.P$4
LTS-
  Top 0.152: R12.1 98.74,14.46 92.65,8.36 92.65,6 X3.5
  Bottom 0.152: F1.P$3 121.68,19.72 121.68,23.98 116.65,29.01 106.9,29.01 93.48,15.6 93.48,6.84 92.65,6 X3.5
LVSEL
  Top 0.152: IC5.14 73.14,32.14 78.09,32.14 78.32,32.37 88.76,32.37 89.37,31.76 IC1.11
LWR  (via drill 0.38)
  Top 0.152: v19.34,60.86 19.34,58.65 22.62,55.38 28.03,55.38 v30.39,57.74 | v74.13,28.17 73.52,28.78 73.14,28.78 IC5.9 | v74.13,20.17 74.13,16.44 71.54,13.85 71.54,12.48 70.09,11.03 v69.41,11.03
  Bottom 0.152: v19.34,60.86 19.04,61.17 18.5,61.17 R49.1 18.5,61.09 17.89,60.48 17.89,58.88 17.59,58.58 16.75,58.58 13.32,55.15 13.32,38.46 17.21,34.57 22.01,34.57 35.42,21.16 35.42,16.52 40.68,11.26 56.76,11.26 59.73,8.29 66.66,8.29 v69.41,11.03 | v30.39,57.74 30.39,58.27 29.93,58.73 29.25,58.73 X1.10 | v74.13,20.17 v74.13,28.17
N$1
  Top 0.152: R1.1 97.83,49.13 93.94,45.24 93.94,34.96 92.42,33.43 92.42,24.82 95.62,21.62 96.08,21.62 IC1.2
N$2
  Top 0.152: R2.1 99.12,25.43 96.15,25.43 IC1.5
N$3
  Top 0.152: R3.1 98.82,28.94 96.61,26.73 96.15,26.73 IC1.6
N$4
  Top 0.152: R4.1 99.12,32.44 98.51,32.44 96.61,30.54 96.15,30.54 IC1.9
N$5  (via drill 0.38)
  Top 0.152: v112.53,44.79 111.62,44.79 R5.1 | v91.5,28.94 89.98,30.46 89.45,30.46 IC1.12
  Bottom 0.152: v112.53,44.79 112.53,44.48 113.3,43.72 113.3,42.65 109.79,39.15 103.62,39.15 93.41,28.94 v91.5,28.94
N$6
  Top 0.152: T8.1 97.83,59.72 101.33,63.23 104.53,63.23 106.51,61.24 106.51,60.94 108.04,59.42 L3.2 108.12,59.42 109.26,60.56 112.38,60.56 SG1.-
N$7
  Top 0.152: T4.3 108.27,45.09 106.74,43.57 104,43.57 103.39,42.96 102.4,42.96 102.1,43.26 101.18,43.26 99.12,41.2 R4.2
N$8
  Top 0.152: T5.3 114.06,41.28 111.93,43.41 111.62,43.41 R5.2
N$9
  Top 0.152: 105.68,27.41 105.68,26.95 103.24,24.52 103.24,20.25 F1.P$1 | 105.68,27.41 105.68,28.4 D2.A | 105.68,27.41 117.94,27.41 121.91,31.37 H1.4
N$10
  Top 0.152: T1.1 102.25,52.94 R7.1
N$11
  Top 0.152: T2.1 101.64,42.58 104.23,42.58 104.91,43.26 107.05,43.26 108.19,44.4 110.1,44.4 113.07,47.38 119.24,47.38 121.3,49.43 121.3,49.74 R8.1
N$12
  Top 0.152: T3.1 121.98,53.17 121.98,52.33 121.37,51.72 R9.1
N$13
  Top 0.152: T1.3 99.5,49.51 99.2,49.21 R1.2
N$14
  Top 0.152: T2.3 100.72,40.52 100.72,39.53 101.33,38.92 101.33,28.94 99.12,26.73 R2.2
N$15  (via drill 0.38)
  Top 0.152: v122.97,52.71 T3.3 | v100.65,31.83 99.12,30.31 R3.2
  Bottom 0.152: v122.97,52.71 122.97,38.77 117.03,32.82 101.64,32.82 v100.65,31.83
N$16
  Top 0.152: T4.1 108.04,43.11 110.1,43.11 111.09,44.1 112.69,44.1 115.66,47.07 121.15,47.07 121.3,47.22 R10.1
N$17
  Top 0.152: R7.2 103.62,52.94 103.62,50.65 103.85,50.42 C1.2 110.71,50.42 113.45,47.68 119.09,47.68 120.69,49.28 120.69,50.27 120.92,50.5 122.67,50.5 | 122.67,50.5 122.67,51.64 R9.2 | 122.67,50.5 122.67,49.81 R8.2 122.67,49.74 122.67,47.3 R10.2 122.67,47.22 122.67,44.71 R11.2 122.59,44.71 121.98,44.1 IC7.7
N$18  (via drill 0.38)
  Top 0.152: 102.02,49.36 102.02,50.42 C1.1 | 102.02,49.36 102.02,46.61 C5.1 | v121.3,39.83 121.3,44.71 R11.1 | v121.3,37.93 121.3,36.94 120.76,36.4 IC7.1 120.69,36.4 119.01,36.4 C6.1 118.94,36.4 118.55,36.02 118.55,31.37 114.9,27.72 110.4,27.72 109.72,28.4 108.27,28.4 D2.C 108.19,28.4 v107.12,28.4 | v110.48,49.36 102.02,49.36
  Bottom 0.152: v121.3,37.93 v121.3,39.83 121.3,40.29 112.23,49.36 v110.48,49.36 | v107.12,28.4 101.71,22.99 101.71,18.95 102.63,18.04 102.63,9.58 F1.P$2
N$19
  Top 0.152: 8.86,28.36 5.85,31.37 H2.4 | 8.86,28.36 8.9,28.33 14.01,28.33 14.85,29.16 15.15,29.16 D1.A | 8.86,28.36 5.17,24.67 5.17,19.94 F2.P$1
N$20  (via drill 0.38)
  Top 0.152: v48.76,21.32 45.02,21.32 43.12,23.22 41.9,23.22 32.45,32.67 30.62,32.67 24.9,38.38 21.25,38.38 18.58,41.05 18.58,41.74 18.5,41.81 18.5,43.72 13.47,48.75 11.49,48.75 11.34,48.6 11.34,47.45 11.65,47.15 11.65,45.4 11.49,45.24 10.58,45.24 10.27,45.55 8.52,45.55 R15.1 | v50.43,22.99 50.43,24.21 51.35,25.13 52.64,25.13 IC2.2
  Bottom 0.152: v50.43,22.99 v48.76,21.32
N$21
  Top 0.152: R13.2 112.15,28.48 112.15,31.15 114.59,33.58 H1.1
N$22
  Top 0.152: T8.3 96.91,57.66 96.91,60.25 97.83,61.17 R14.2
N$23
  Top 0.305: U$1.P$1 110.4,36.63 113.45,36.63 115.81,34.27 115.81,30.31 114.67,29.16 H1.3
N$24
  Top 0.152: R16.1 24.6,50.42 30.7,44.33 30.7,35.87 33.29,33.28 33.9,33.28 33.97,33.2 40.6,33.2 41.74,32.06 48.07,32.06 51.12,29.01 52.64,29.01 IC2.5
N$25  (via drill 0.38)
  Top 0.152: v8.37,48.6 8.37,49.89 R17.1 | v33.29,19.11 39.46,19.11 39.54,19.03 44.11,19.03 44.56,19.49 v44.56,20.48 | v54.32,29.09 53.17,30.23 IC2.6
  Bottom 0.152: v8.37,48.6 8.37,37.55 20.26,25.66 26.73,25.66 v33.29,19.11 | v44.56,20.48 48.76,20.48 54.32,26.04 v54.32,29.09
N$26  (via drill 0.38)
  Top 0.152: v21.63,46 21.63,45.7 23.61,43.72 23.61,39.07 23.99,38.69 25.06,38.69 30.77,32.97 33.74,32.97 34.05,32.67 39.31,32.67 v39.38,32.59 | v51.04,34.19 52.49,34.19 52.64,34.04 IC2.9
  Bottom 0.152: v21.63,46 21.63,49.21 18.43,52.41 18.43,57.66 R18.1 | v39.38,32.59 40.98,34.19 v51.04,34.19
N$27
  Top 0.152: R19.1 12.79,65.13 23.91,65.13 29.78,59.26 29.78,59.11 30.54,58.35 30.62,58.35 33.44,55.53 33.44,34.65 34.12,33.97 45.86,33.97 45.94,34.04 IC2.12
N$28  (via drill 0.38)
  Top 0.152: v18.58,47.22 v24.22,47.22 | v16.37,45.01 16.37,44.79 15.68,44.1 R44.2
  Bottom 0.152: v24.22,47.22 24.52,46.92 24.52,46.23 T13.3 | v16.37,45.01 v18.58,47.22
N$29
  Top 0.152: T6.3 10.96,46 9.21,46 8.9,46.31 7.91,46.31 7.23,45.62 R15.2
N$30
  Top 0.152: T7.3 13.25,53.93 13.09,53.93 11.49,52.33 11.49,50.42 R16.2
N$31  (via drill 0.38)
  Top 0.152: v7.45,55.99 8.45,55.99 T9.3 | v8.06,50.88 7.07,49.89 R17.2
  Bottom 0.152: v7.45,55.99 7.45,51.49 v8.06,50.88
N$32  (via drill 0.38)
  Top 0.152: v16.83,56.67 16.52,56.37 15.76,56.37 14.39,57.74 13.17,57.74 T10.3
  Bottom 0.152: v16.83,56.67 16.83,57.43 R18.2
N$33
  Top 0.152: T11.3 13.09,62.92 13.09,63.53 11.49,65.13 R19.2
N$34
  Top 0.152: D4.A 61.02,2.72 61.02,3.1 62.47,4.55 62.47,6.08 60.72,7.83 60.26,7.83 IC6.1
N$35
  Top 0.152: T6.1 11.95,47.99 11.95,45.24 11.49,44.79 11.04,44.79 10.27,44.02 10.27,38.99 R22.1
N$36
  Top 0.152: T7.1 12.26,51.95 12.26,51.03 12.1,50.88 12.1,49.89 9.89,47.68 8.22,47.68 R23.1
N$37
  Top 0.152: T9.1 6.46,56.98 6.46,56.06 7.68,54.84 7.68,52.56 7.07,51.95 R24.1
N$38
  Top 0.152: T10.1 9.74,55.76 8.37,54.39 R25.1
N$39
  Top 0.152: 6.88,50.92 7.23,51.26 7.61,51.26 8.29,51.95 R24.2 | 6.88,50.92 6.39,50.42 6.39,49.43 6.85,48.98 6.85,47.68 R23.2 6.85,47.61 6.85,46.46 4.56,44.18 4.56,41.66 IC8.7 4.56,41.59 4.56,41.05 6.62,38.99 R22.2 8.98,38.99 9.97,38 14.01,38 | 6.88,50.92 6.39,51.42 6.39,52.48 7,53.09 7,54.31 R25.2 | 14.01,38 14.01,36.71 13.78,36.48 C2.2 | 14.01,38 14.01,38.99 R26.2
N$40  (via drill 0.38)
  Top 0.152: C8.1 30.16,19.49 30.16,23.91 29.93,24.14 C7.1 24.45,24.14 19.34,29.24 17.82,29.24 D1.C 17.74,29.24 17.74,31.15 18.12,31.53 18.12,32.52 17.74,32.9 12.18,32.9 11.87,33.2 11.87,35.03 | 11.87,35.03 11.87,36.4 C2.1 11.8,36.48 10.88,37.39 v10.66,37.39 | R26.1 11.95,38.99 v11.57,38.61 | 3.68,35.45 4.1,35.03 11.87,35.03 | 3.68,35.45 3.26,35.87 3.26,36.33 IC8.1 | 3.68,35.45 2.43,34.19 2.43,20.94 5.09,18.27 5.09,9.81 F2.P$2
  Bottom 0.152: v11.57,38.61 11.57,38.31 v10.66,37.39
N$41
  Bottom 0.152: T12.1 23.61,52.1 23.61,53.02 24.14,53.55 R37.1
N$42
  Top 0.152: R21.2 16.14,31.98 15.99,31.98 13.17,29.16 H2.1
N$43
  Top 0.152: T15.1 11.95,42.73 11.95,43.57 11.49,44.02 R38.1
N$44  (via drill 0.38)
  Top 0.152: v22.16,44.33 21.17,45.32 20.1,45.32 T14.1
  Bottom 0.152: R39.1 v22.16,44.33
N$45
  Top 0.152: T5.1 113.14,39.22 113.83,39.22 115.2,37.85 120.38,37.85 121.07,38.54 122.9,38.54 124.5,36.94 124.5,36.4 IC7.4
N$46
  Bottom 0.152: T13.1 23.61,48.21 23.61,44.94 23.69,44.86 23.69,42.42 23.08,41.81 R40.1
N$47
  Top 0.152: T11.1 12.1,60.79 8.98,60.79 3.95,55.76 3.95,40.37 5.7,38.61 5.85,38.61 7,37.47 7,36.4 IC8.4
N$48
  Top 0.152: T14.3 19.19,43.26 19.19,41.59 R43.2
N$49  (via drill 0.38)
  Top 0.152: v25.13,49.05 25.13,40.59 24.22,39.68 R41.2
  Bottom 0.152: v25.13,49.05 24.6,49.59 24.6,50.04 T12.3
N$50
  Top 0.152: T15.3 11.04,40.59 11.8,40.59 12.48,39.91 13.78,39.91 15.38,41.51 R42.2
N$51
  Top 0.305: U$2.P$1 20.94,32.59 18.66,32.59 17.67,33.58 13.17,33.58 H2.3
N$52
  Top 0.152: IC6.6 65.44,5.39 67.35,5.39 R32.2 67.35,5.47 67.35,7.6 R31.1
N$54
  Top 0.152: 57.75,6.61 57.75,7.6 R29.1 | 57.75,6.61 57.75,5.39 R30.2 | IC6.2 57.75,6.61
N$55  (via drill 0.38)
  Top 0.152: v64.99,3.26 65.52,2.72 65.82,2.72 D5.A | v68.26,4.7 64.3,4.7 64.07,4.93 64.07,5.77 64.91,6.61 IC6.7
  Bottom 0.152: v64.99,3.26 66.81,3.26 v68.26,4.7
RADC
  Top 0.152: D5.C 63.31,2.72 63.31,4.78 62.78,5.31 62.78,7.75 65.52,10.5 C14.1 | R31.2 67.35,8.97 67.12,8.97 66.59,9.51 66.43,9.51 65.52,10.42 C14.1 | IC5.27 66.59,30.76 69.79,27.56 69.79,17.81 66.51,14.53 66.51,11.49 65.6,10.57 C14.1
RCLOCK  (via drill 0.38)
  Top 0.152: v44.03,28.1 44.87,28.94 45.94,28.94 IC2.16 | v48.76,23.37 48.76,22.15 50.2,20.71 50.2,9.05 X4.3
  Bottom 0.152: v48.76,23.37 v44.03,28.1
RCLR  (via drill 0.38)
  Top 0.152: v43.65,23.98 44.79,25.13 45.94,25.13 IC2.19 | v42.89,22.61 43.27,22.61 45.17,20.71 45.17,11.26 44.49,10.57 44.49,7.14 47.23,4.4 48.68,4.4 50.97,6.69 50.97,8.97 X4.4
  Bottom 0.152: v43.65,23.98 43.65,23.37 v42.89,22.61
RDIN  (via drill 0.38)
  Top 0.152: IC2.15 44.95,30.23 v43.42,28.71 | v45.78,19.87 45.78,14 49.36,10.42 49.36,9.05 X4.2
  Bottom 0.152: v43.42,28.71 43.42,27.03 45.02,25.43 45.02,22.69 43.42,21.09 41.67,21.09 41.29,20.71 41.29,20.25 41.67,19.87 v45.78,19.87
RHVTRIG  (via drill 0.38)
  Top 0.152: v41.82,14.61 33.29,14.61 29.32,18.57 29.32,18.8 22.92,25.2 20.64,25.2 17.06,28.78 17.06,29.62 17.44,30 17.44,31.98 R21.1 | v62.01,20.25 v60.11,18.34 | v63.92,20.25 66.43,20.25 v68.57,22.38 | v71.08,24.9 73.06,24.9 IC5.3
  Bottom 0.152: v41.82,14.61 45.55,18.34 v60.11,18.34 | v63.92,20.25 v62.01,20.25 | v71.08,24.9 v68.57,22.38
ROPA  (via drill 0.38)
  Top 0.152: U$2.P$4 21.02,37.39 21.7,38.08 24.75,38.08 30.54,32.29 R28.1 30.54,31.98 33.9,28.63 v33.9,20.48 | v63.39,6 63.39,5.16 64.45,4.09 65.37,4.09 IC6.5
  Bottom 0.152: v63.39,6 54.62,6 51.65,8.97 41.14,8.97 33.9,16.21 v33.9,20.48
RTS+
  Top 0.152: F2.P$4 27.76,13.35 | 27.76,13.35 28.11,13.7 28.11,14.15 R27.2 | 27.76,13.35 X5.1
RTS-
  Top 0.152: F2.P$3 24.22,19.94 28.11,16.06 28.11,15.52 R27.1 28.18,15.45 31.46,15.45 41.14,5.77 43.27,5.77 X5.5
RVSEL
  Top 0.152: IC5.25 65.37,32.14 59.88,32.14 56.98,35.03 54.7,35.03 53.86,35.87 46.55,35.87 46.01,35.34 IC2.11
SPKR  (via drill 0.38)
  Top 0.152: v96.3,58.65 96.53,58.88 96.53,61.17 R14.1 | v96.91,53.85 96.91,53.55 96.76,53.4 96.76,51.8 96.91,51.64 96.91,48.67 93.48,45.24 93.48,39.76 92.57,38.84 85.71,38.84 v84.04,37.17 | v82.82,35.95 80.68,35.95 78.47,38.16 71.31,38.16 69.25,36.1 69.25,33.28 71.69,30.84 73.06,30.84 IC5.12
  Bottom 0.152: v96.3,58.65 96.3,56.75 96.91,56.14 v96.91,53.85 | v82.82,35.95 v84.04,37.17
TCK
  Top 0.152: IC5.35 65.44,25.51 66.74,25.51 67.65,24.59 68.19,24.59 69.48,23.3 69.48,17.96 65.52,14 65.52,13.77 SV1.3
  Bottom 0.152: S5.4 106.97,37.62 102.93,37.62 83.58,18.27 70.09,18.27 65.52,13.7 SV1.3
TDI
  Top 0.152: IC5.37 65.44,24.29 68.03,24.29 69.18,23.14 69.18,22.15 65.82,18.8 65.44,18.8 60.41,13.77 SV1.5
  Bottom 0.152: S7.4 50.58,17.05 52.11,15.52 58.59,15.52 SV1.5
TDO
  Top 0.152: SV1.6 59.65,15.52 60.95,15.52 62.93,17.51 62.93,20.1 65.37,22.54 65.37,23.6 IC5.38
TEST
  Top 0.152: SV1.1 70.55,20.4 73.06,22.92 73.06,23.6 IC5.1
TMS  (via drill 0.38)
  Top 0.152: v62.09,17.51 62.62,18.04 62.62,22.54 64.99,24.9 65.37,24.9 IC5.36
  Bottom 0.152: SV1.4 62.93,13.77 62.09,14.61 v62.09,17.51 60.03,19.56 56.91,19.56 56.6,19.26 39.15,19.26 23.23,35.18 19.88,35.18 16.83,38.23 16.22,38.23 S6.4
VBAT  (via drill 0.38)
  Top 0.152: 96.65,40.86 96.69,40.82 97.9,40.82 v100.27,43.19 | 96.65,40.86 96,41.51 R45.1 | v103.16,43.57 102.78,43.57 102.32,44.02 R46.2 | v66.43,30.08 65.44,30.08 IC5.28 | v94.63,33.97 94.63,38.84 96.65,40.86
  Bottom 0.152: v100.27,43.19 102.78,43.19 v103.16,43.57 | v66.43,30.08 64.76,30.08 60.64,25.96 60.64,20.78 64.68,16.74 64.68,16.29 64.83,16.13 67.5,16.13 70.93,19.56 81.9,19.56 83.05,20.71 83.05,22.38 v94.63,33.97
VCC  (via drill 0.38)
  Top 0.305: v47.84,9.89 47.84,9.81 48.6,9.05 X4.1 | v72.99,9.58 73.44,9.58 73.75,9.28 X2.1 | C10.1 100.57,64.37 105.45,64.37 107.96,61.85 L3.1 108.12,61.85 111.62,61.85 111.77,62.01 117.41,62.01 118.78,60.64 SG1.+ 118.94,60.56 123.74,55.76 123.74,44.56 122.59,43.41 122.59,40.14 121.6,39.15 120.99,39.15 120.08,40.06 120.08,40.75 118.55,42.27 118.55,42.35 | 118.55,42.35 IC3.3 | v98.82,24.52 99.5,24.52 106.29,31.3 106.29,32.97 v106.74,33.43 | v118.4,42.35 118.55,42.35
  Bottom 0.305: v47.84,9.89 52.11,9.89 52.34,10.11 56.38,10.11 59.19,7.3 69.18,7.3 71.46,9.58 v72.99,9.58 73.06,9.66 79.08,9.66 85.48,16.06 85.94,16.06 86.78,16.9 86.78,17.73 93.56,24.52 v98.82,24.52 | v106.74,33.43 109.56,33.43 118.4,42.27 v118.4,42.35
XIN
  Top 0.152: IC5.6 73.14,26.88 76.64,26.88 Q3.2 78.17,28.48 79.08,29.39 79.08,31.37 C12.1
XOUT
  Top 0.152: 78.17,26.65 77.79,26.27 73.14,26.27 IC5.5 | 78.17,26.65 80.68,26.65 C11.1 | 78.17,26.65 Q3.1

## Text on the board
DrillLegend: LAYER-STACK
DrillLegend_01-16: 01-16
DrillLegend_01-20: 01-20